# EAGLE design damp_v0003 (EAGLE 6.4)

## Sheet 1 of 2: DAC
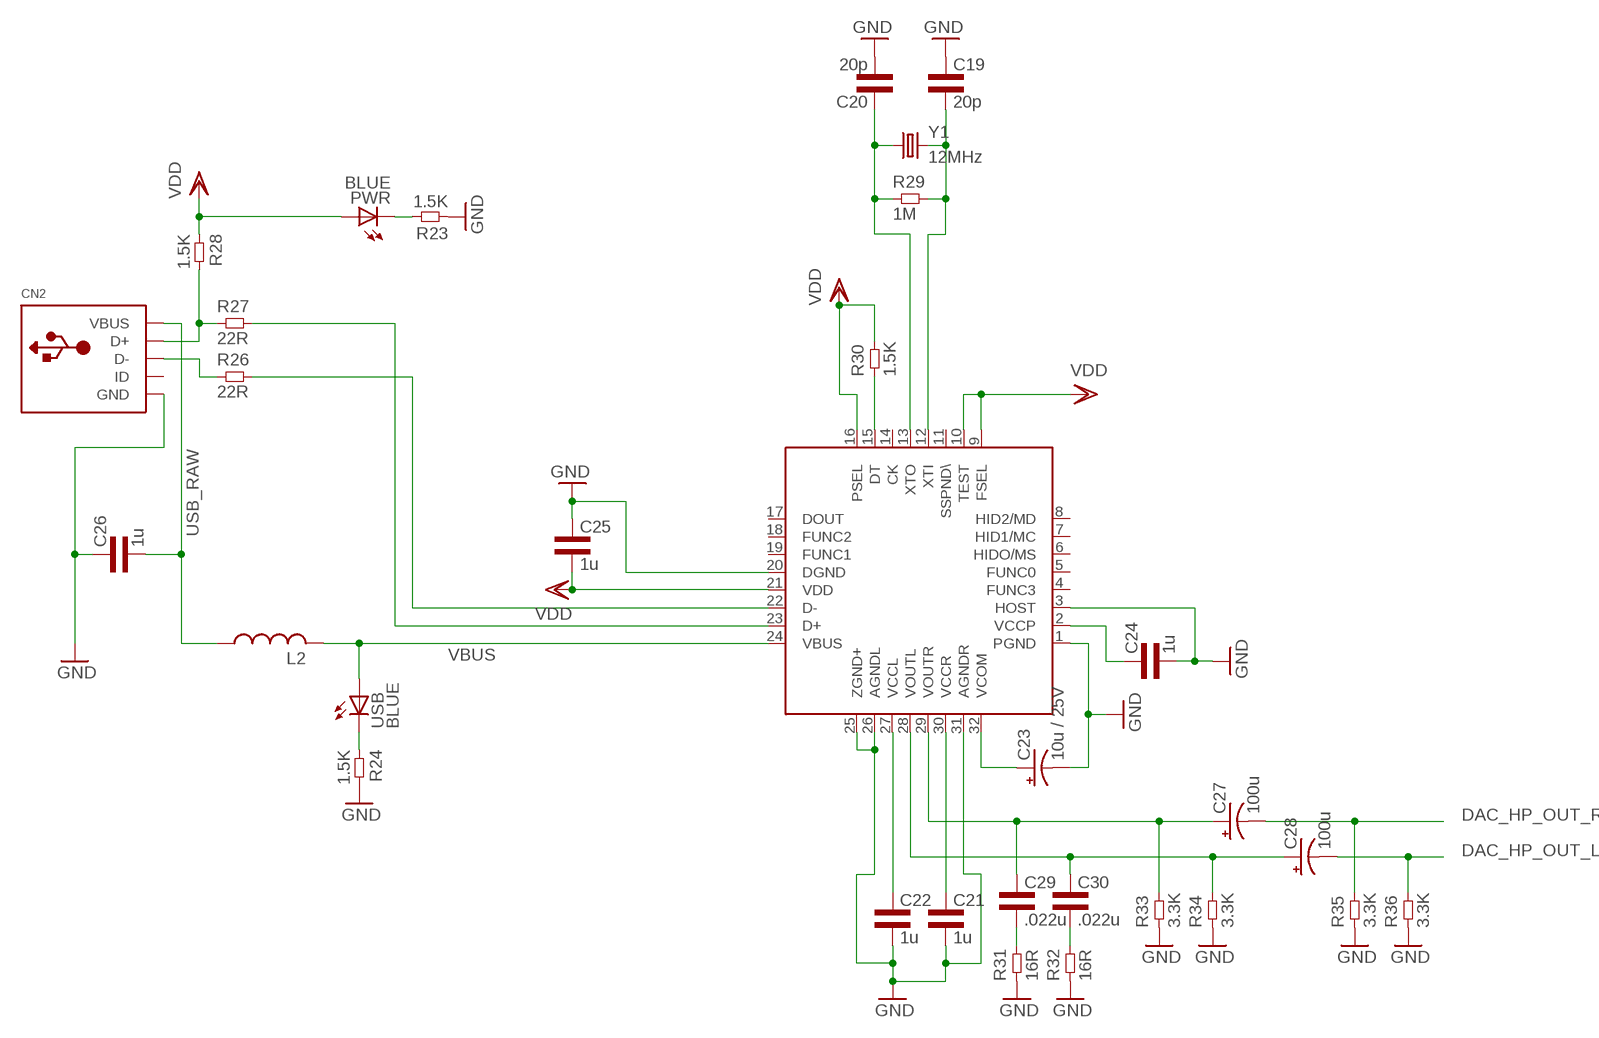
[diagram p0: schematic, sheet 1]

### Parts
C19  20p  CAP0603L3  [0603L3]
C20  20p  CAP0603L3  [0603L3]
C21  1u  CAP0603L3  [0603L3]
C22  1u  CAP0603L3  [0603L3]
C23  10u / 25V  CPOL-USB  [PANASONIC_B]
C24  1u  CAP0603L3  [0603L3]
C25  1u  CAP0603L3  [0603L3]
C26  1u  CAP0603L3  [0603L3]
C27  100u  CPOL-USD  [PANASONIC_D]
C28  100u  CPOL-USD  [PANASONIC_D]
C29  .022u  CAP0603L3  [0603L3]
C30  .022u  CAP0603L3  [0603L3]
CN2  USBMINIB  [USB-MINIB]
L2  RCL_L-USL3225M  [RCL_L3225M]
PWR  BLUE  LED-BLUE0603  [LED-0603]
R23  1.5K  RES0603L3  [0603L3]
R24  1.5K  RES0603L3  [0603L3]
R26  22R  RES0603L3  [0603L3]
R27  22R  RES0603L3  [0603L3]
R28  1.5K  RES0603L3  [0603L3]
R29  1M  RES0603L3  [0603L3]
R30  1.5K  RES0603L3  [0603L3]
R31  16R  RES0603L3  [0603L3]
R32  16R  RES0603L3  [0603L3]
R33  3.3K  RES0603L3  [0603L3]
R34  3.3K  RES0603L3  [0603L3]
R35  3.3K  RES0603L3  [0603L3]
R36  3.3K  RES0603L3  [0603L3]
U$1  PCM2707_V1_PCM2704C_PCM2707  [PCM2707_V1_PCM2704C_PCM2707]
USB  BLUE  LED-BLUE0603  [LED-0603]
Y1  12MHz  CRYSTALHC49US  [HC49US]

### Nets
D_N: CN2.D- R26.P$1
D_P: CN2.D+ R27.P$1 R28.P$2
DAC_HP_OUT_L: C28.- R36.P$2 ; also sheet 2
DAC_HP_OUT_R: C27.- R35.P$2 ; also sheet 2
GND: C19.P$1 C20.P$2 C21.P$2 C22.P$2 C23.- C24.P$2 C25.P$1 C26.P$1 CN2.GND R23.P$1 R24.P$2 R31.P$1 R32.P$1 R33.P$1 R34.P$1 R35.P$1 R36.P$1 U$1.1(PGND) U$1.3(HOST) U$1.20(DGND) U$1.25(ZGND+) U$1.26(AGNDL) U$1.31(AGNDR) ; also sheet 2
N$2: PWR.C R23.P$2
N$6: R24.P$1 USB.C
N$43: C20.P$1 R29.P$1 U$1.13(XTO) Y1.1
N$44: C19.P$2 R29.P$2 U$1.12(XTI) Y1.2
N$45: C22.P$1 U$1.27(VCCL)
N$50: C21.P$1 U$1.30(VCCR)
N$51: C23.+ U$1.32(VCOM)
N$52: C29.P$2 R31.P$2
N$53: C24.P$1 U$1.2(VCCP)
N$54: C27.+ C29.P$1 R33.P$2 U$1.29(VOUTR)
N$57: C28.+ C30.P$1 R34.P$2 U$1.28(VOUTL)
N$58: R30.P$1 U$1.15(DT)
N$59: C30.P$2 R32.P$2
USB_D_N: R26.P$2 U$1.22(D-)
USB_D_P: R27.P$2 U$1.23(D+)
USB_RAW: C26.P$2 CN2.VBUS L2.1
VBUS: L2.2 U$1.24(VBUS) USB.A
VDD: C25.P$2 PWR.A R28.P$1 R30.P$2 U$1.9(FSEL) U$1.10(TEST) U$1.16(PSEL) U$1.21(VDD)
Unconnected: CN2.ID U$1.4(FUNC3) U$1.5(FUNC0) U$1.6(HIDO/MS) U$1.7(HID1/MC) U$1.8(HID2/MD) U$1.11(SSPND\) U$1.14(CK) U$1.17(DOUT) U$1.18(FUNC2) U$1.19(FUNC1)

## Sheet 2 of 2: Amp
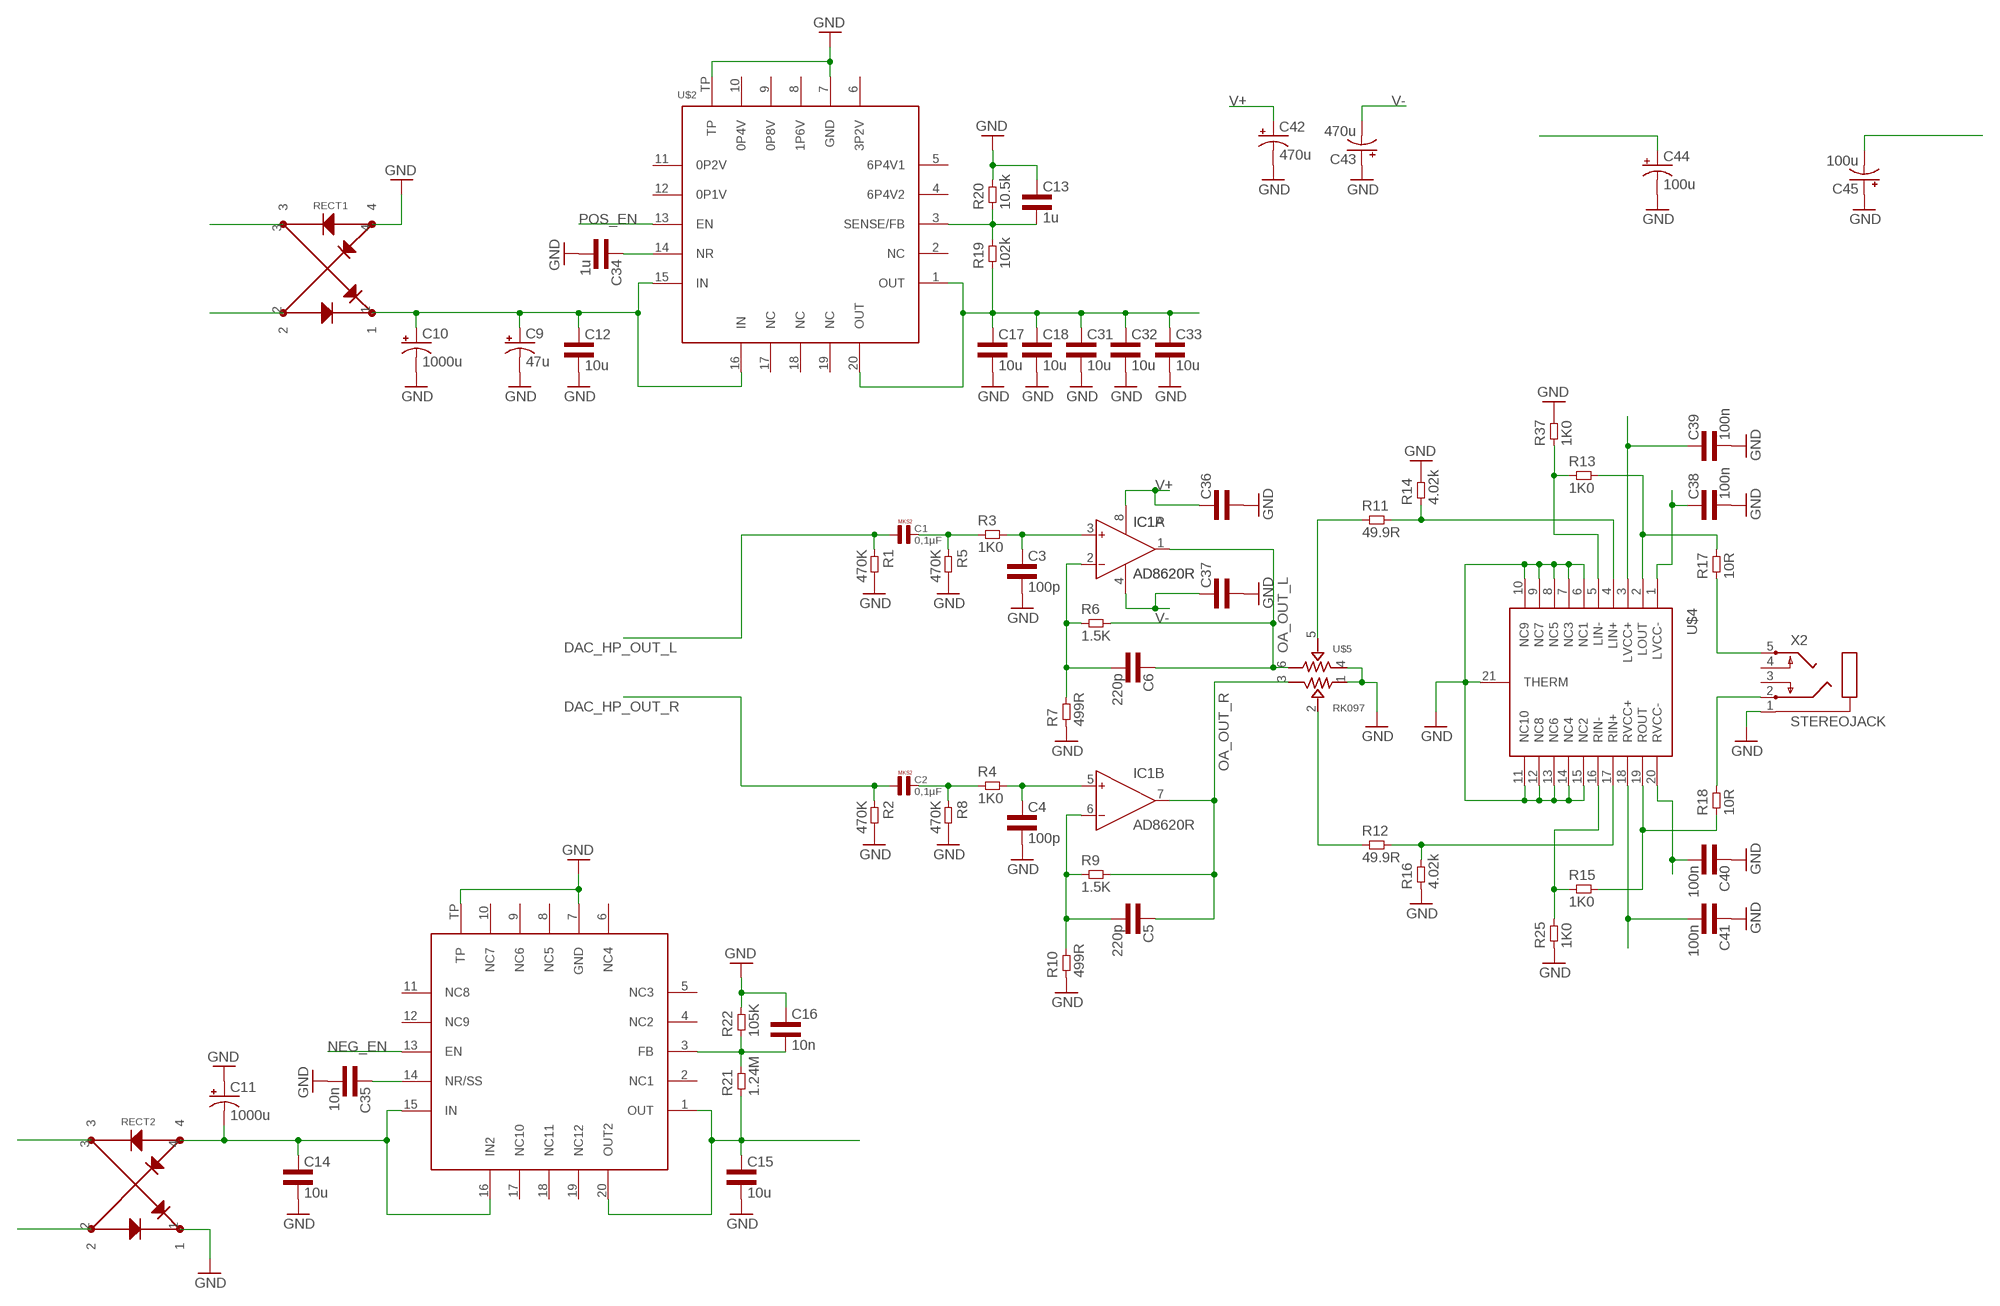
[diagram p1: schematic, sheet 2]

### Parts
C1  0,1µF  [R5B2K5]
C2  0,1µF  [R5B2K5]
C3  100p  CAP0603L3  [0603L3]
C4  100p  CAP0603L3  [0603L3]
C5  220p  CAP0603L3  [0603L3]
C6  220p  CAP0603L3  [0603L3]
C9  47u  CPOL-USCT7343  [CT7343]
C10  1000u  CPOL-USE7.5-18  [E7,5-18]
C11  1000u  CPOL-USE7.5-18  [E7,5-18]
C12  10u  CAP0805L3  [0805L3]
C13  1u  CAP0603L3  [0603L3]
C14  10u  CAP0805L3  [0805L3]
C15  10u  CAP0805L3  [0805L3]
C16  10n  CAP0603L3  [0603L3]
C17  10u  CAP0805L3  [0805L3]
C18  10u  CAP0805L3  [0805L3]
C31  10u  CAP0805L3  [0805L3]
C32  10u  CAP0805L3  [0805L3]
C33  10u  CAP0805L3  [0805L3]
C34  1u  CAP0603L3  [0603L3]
C35  10n  CAP0603L3  [0603L3]
C36  CAP0603L3  [0603L3]
C37  CAP0603L3  [0603L3]
C38  100n  CAP0603L3  [0603L3]
C39  100n  CAP0603L3  [0603L3]
C40  100n  CAP0603L3  [0603L3]
C41  100n  CAP0603L3  [0603L3]
C42  470u  CPOL-USG  [PANASONIC_G]
C43  470u  CPOL-USG  [PANASONIC_G]
C44  100u  CPOL-USD  [PANASONIC_D]
C45  100u  CPOL-USD  [PANASONIC_D]
IC1  AD8620R  [SO8]
R1  470K  RES0603L3  [0603L3]
R2  470K  RES0603L3  [0603L3]
R3  1K0  RES0603L3  [0603L3]
R4  1K0  RES0603L3  [0603L3]
R5  470K  RES0603L3  [0603L3]
R6  1.5K  RES0603L3  [0603L3]
R7  499R  RES0603L3  [0603L3]
R8  470K  RES0603L3  [0603L3]
R9  1.5K  RES0603L3  [0603L3]
R10  499R  RES0603L3  [0603L3]
R11  49.9R  RES0603L3  [0603L3]
R12  49.9R  RES0603L3  [0603L3]
R13  1K0  RES0603L3  [0603L3]
R14  4.02k  RES0603L3  [0603L3]
R15  1K0  RES0603L3  [0603L3]
R16  4.02k  RES0603L3  [0603L3]
R17  10R  RES1206L3  [1206L3]
R18  10R  RES1206L3  [1206L3]
R19  102k  RES0603L3  [0603L3]
R20  10.5k  RES0603L3  [0603L3]
R21  1.24M  RES0603L3  [0603L3]
R22  105K  RES0603L3  [0603L3]
R25  1K0  RES0603L3  [0603L3]
R37  1K0  RES0603L3  [0603L3]
RECT1  RECTIFIER_Z4GP206  [RECTIFIER_ABS-4]
RECT2  RECTIFIER_Z4GP206  [RECTIFIER_ABS-4]
U$2  POWER-SUPPLY_POS_V1_TI_LDO_TPS7A4700  [POWER-SUPPLY_POS_V1_TI_LDO_VQFN-20]
U$3  POWER-SUPPLY_POS_V1_TI_LDO_TPS7A3301RGWT  [POWER-SUPPLY_POS_V1_TI_LDO_VQFN-20]
U$4  PCM2707_V1_AMP_TPA6120_TPA6120  [PCM2707_V1_AMP_TPA6120_TPA6120]
U$5  RK097  [RK097]
X2  STEREOJACK  [STX3100]

### Nets
AC1: RECT1.3
AC2: RECT1.2
AC3: RECT2.3
AC4: RECT2.2
DAC_HP_OUT_L: C1.1 R1.P$1 ; also sheet 1
DAC_HP_OUT_R: C2.1 R2.P$1 ; also sheet 1
GND: C3.P$2 C4.P$2 C9.- C10.- C11.+ C12.2 C13.P$1 C14.2 C15.2 C16.P$1 C17.2 C18.2 C31.2 C32.2 C33.2 C34.P$2 C35.P$2 C36.P$2 C37.P$2 C38.P$2 C39.P$2 C40.P$1 C41.P$1 C42.- C43.+ C44.- C45.+ R1.P$2 R2.P$2 R5.P$2 R7.P$1 R8.P$2 R10.P$1 R14.P$2 R16.P$1 R20.P$2 R22.P$2 R25.P$1 R37.P$2 RECT1.4 RECT2.1 U$2.7(GND) U$2.TP U$3.7(GND) U$3.TP U$4.6(NC1) U$4.7(NC3) U$4.8(NC5) U$4.9(NC7) U$4.10(NC9) U$4.11(NC10) U$4.12(NC8) U$4.13(NC6) U$4.14(NC4) U$4.15(NC2) U$4.21(THERM) U$5.1 U$5.4 X2.1 ; also sheet 1
N$1: R11.P$1 U$5.5
N$3: R11.P$2 R14.P$1 U$4.4(LIN+)
N$4: C34.P$1 U$2.14(NR)
N$7: C1.2 R3.P$1 R5.P$1
N$8: C3.P$1 IC1.3(A:IN+) R3.P$2
N$9: C6.P$2 IC1.2(A:IN-) R6.P$1 R7.P$2
N$10: R12.P$2 R16.P$2 U$4.17(RIN+)
N$11: R12.P$1 U$5.2
N$12: C2.2 R4.P$1 R8.P$1
N$13: C4.P$1 IC1.5(B:IN+) R4.P$2
N$14: R13.P$2 R17.2 U$4.2(LOUT)
N$15: C5.P$2 IC1.6(B:IN-) R9.P$1 R10.P$2
N$16: R15.P$2 R18.1 U$4.19(ROUT)
N$17: R13.P$1 R37.P$1 U$4.5(LIN-)
N$19: R15.P$1 R25.P$2 U$4.16(RIN-)
N$20: R17.1 X2.5
N$22: R18.2 X2.2
N$23: C13.P$2 R19.P$2 R20.P$1 U$2.3(SENSE/FB)
N$24: C16.P$2 R21.P$2 R22.P$1 U$3.3(FB)
N$25: C35.P$1 U$3.14(NR/SS)
NEG_EN: U$3.13(EN)
NEG_RAW: C11.- C14.1 RECT2.4 U$3.15(IN) U$3.16(IN2)
OA_OUT_L: C6.P$1 IC1.1(A:OUT) R6.P$2 U$5.6
OA_OUT_R: C5.P$1 IC1.7(B:OUT) R9.P$2 U$5.3
POS_EN: U$2.13(EN)
POS_RAW: C9.+ C10.+ C12.1 RECT1.1 U$2.15(IN) U$2.16(IN)
V+: C17.1 C18.1 C31.1 C32.1 C33.1 C36.P$1 C39.P$1 C41.P$2 C42.+ C44.+ IC1.8(P:V+) R19.P$1 U$2.1(OUT) U$2.20(OUT) U$4.3(LVCC+) U$4.18(RVCC+)
V-: C15.1 C37.P$1 C38.P$1 C40.P$2 C43.- C45.- IC1.4(P:V-) R21.P$1 U$3.1(OUT) U$3.20(OUT2) U$4.1(LVCC-) U$4.20(RVCC-)
Unconnected: U$2.2(NC) U$2.4(6P4V2) U$2.5(6P4V1) U$2.6(3P2V) U$2.8(1P6V) U$2.9(0P8V) U$2.10(0P4V) U$2.11(0P2V) U$2.12(0P1V) U$2.17(NC) U$2.18(NC) U$2.19(NC) U$3.2(NC1) U$3.4(NC2) U$3.5(NC3) U$3.6(NC4) U$3.8(NC5) U$3.9(NC6) U$3.10(NC7) U$3.11(NC8) U$3.12(NC9) U$3.17(NC10) U$3.18(NC11) U$3.19(NC12) X2.3 X2.4

## Library data of the parts
C1 C2 = Capacitor-Wima-MKS2-63v:0,1µF
C3-C6 C12-C22 C24-C26 C29-C41 = common:CAP
C9-C11 C23 C27 C28 C42-C45 = rcl:CPOL-US: POLARIZED CAPACITOR, American symbol
CN2 = adafruit:USB: USB Connectors USBMINIB - Surface Mount Female Mini-B USB Connector 4UConnector: 06564 By microbuilder.eu Thru-hole RA Female Mini-B USB Connector 4UConnector: 18732 By ladyada.net
IC1 = analog-devices:AD8620: Precision, Very Low Noise, Low Input Bias Current, Wide Bandwidth JFET Operational Amplifiers Source: http://www.analog.com/static/imported-files/data_sheets/AD8610_8620.pdf; MF: ALTERA CORPORATION; MPN: AD8620ARZ; OC_FARNELL: 9994386; OC_NEWARK: 59K6972
L2 = pcm2707_v1:RCL_L-US: INDUCTOR, American symbol
PWR USB = SparkFun-LED:LED-BLUE: Blue LEDs for production use Various blue LEDs stocked by SparkFun production 0603 - DIO-08575 Rebel - DIO-09553 1206 - DIO-09911; PROD_ID: DIO-08575
R1-R37 = common:RES
RECT1 RECT2 = my_dac_amp:RECTIFIER_Z4GP206
U$1 = my_dac_amp:PCM2707_V1_PCM2704C_PCM2707: Upgraded version of the PCM2704. It allows connecting to a device with USB and transmitting that data to another DAC using I2S protocol. Also has other advanced features that allow control with SPI, external buttons, etc.
U$2 = my_dac_amp:POWER-SUPPLY_POS_V1_TI_LDO_TPS7A4700
U$3 = my_dac_amp:POWER-SUPPLY_POS_V1_TI_LDO_TPS7A3301RGWT: Ultra-Low Noise NEGATIVE Voltage Reglator
U$4 = my_dac_amp:PCM2707_V1_AMP_TPA6120_TPA6120
U$5 = SparkFun-Electromechanical:RK097
X2 = adafruit:STEREOJACK: MIC/HEADPHONE JACK Stereo jack with two switches. Kycon STX3100, CUI SJ1-3555NG and/or 4UCon 05544
Y1 = SparkFun-FreqCtrl:CRYSTAL: Various standard crystals. Proven footprints. Spark Fun Electronics SKU : COM-00534

## Board
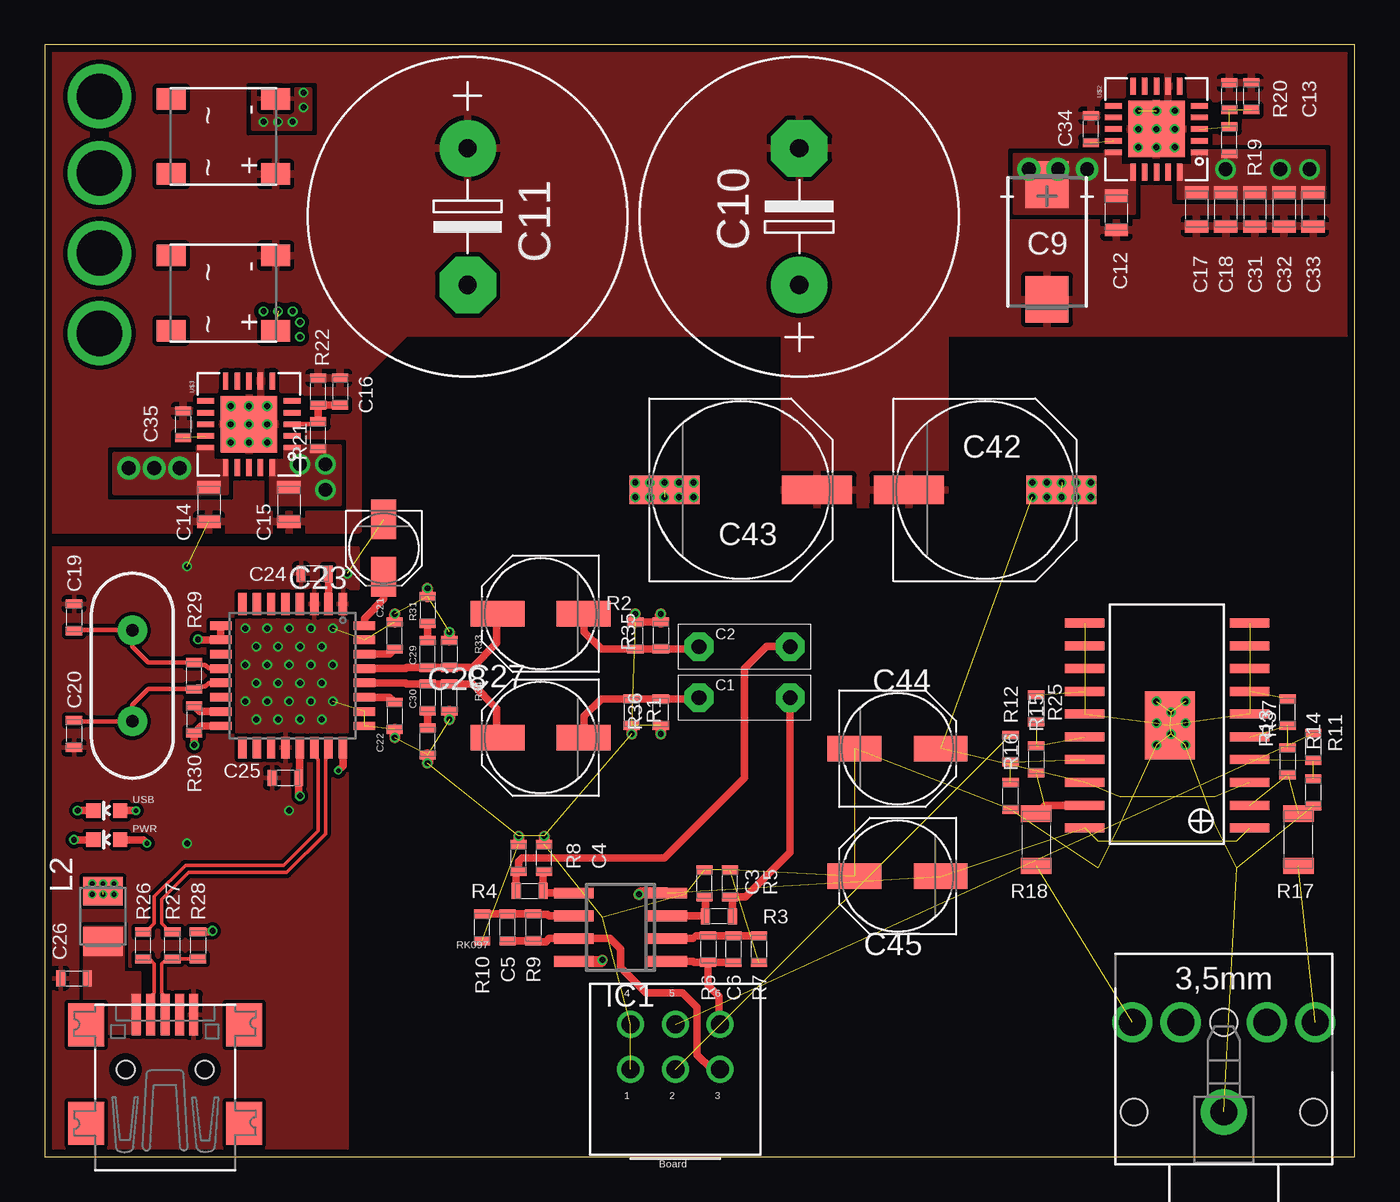
[diagram p2: board, top side]
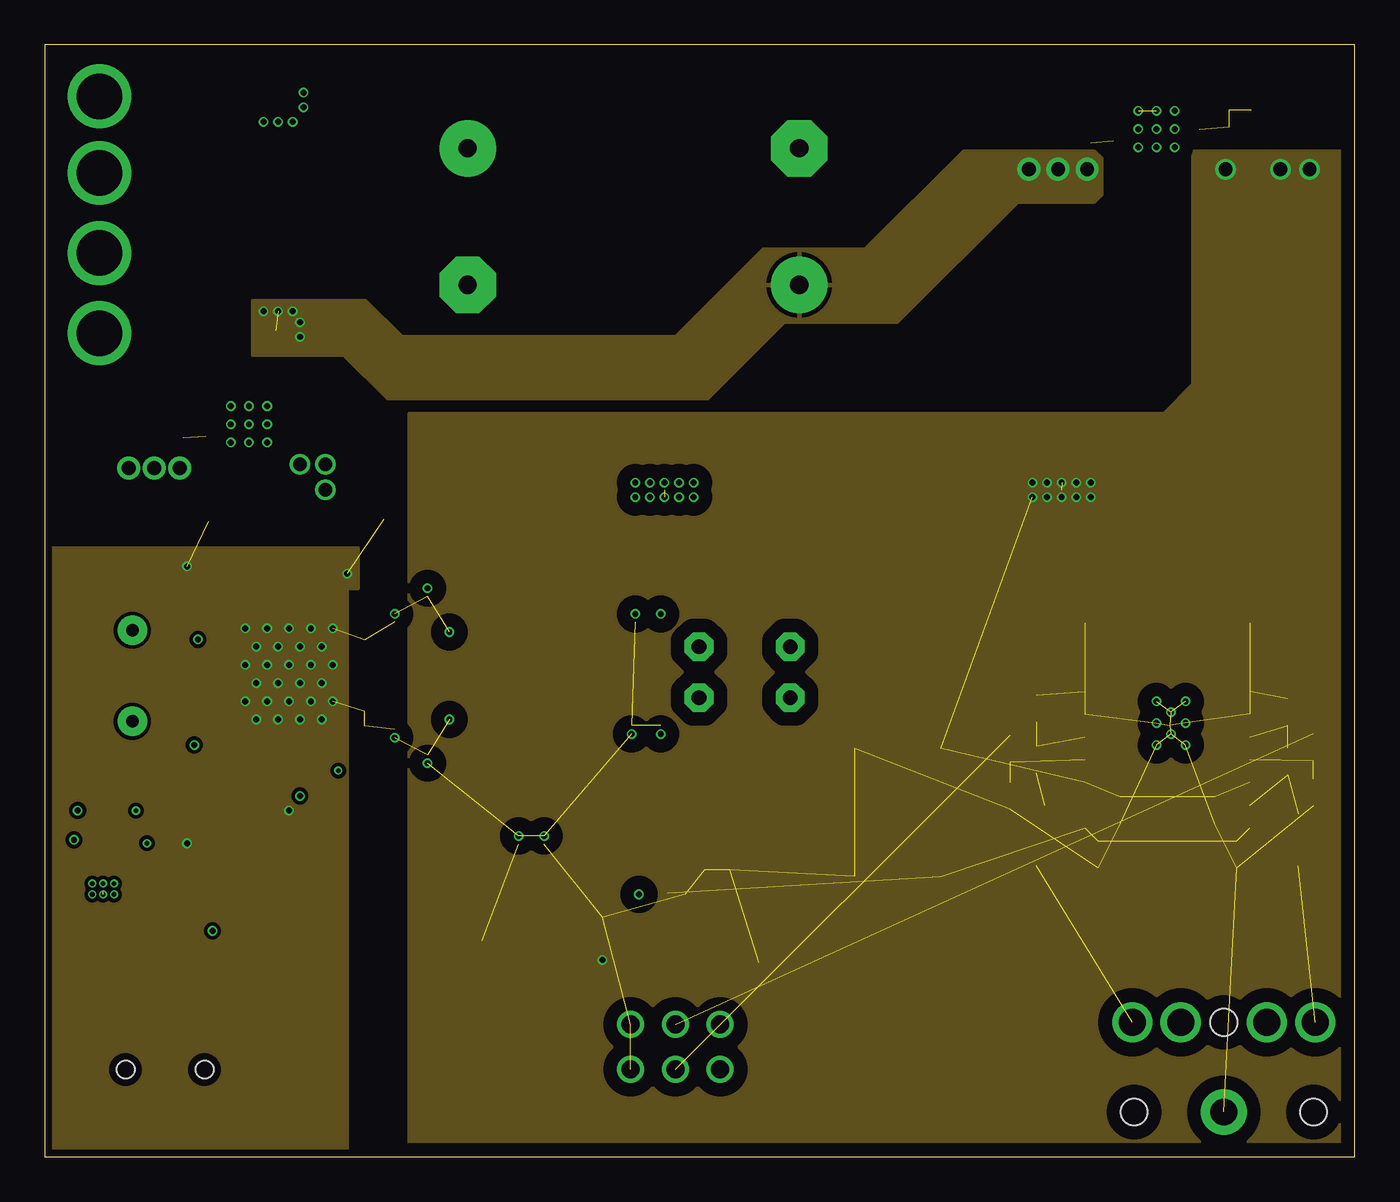
[diagram p3: board, inner layer Route2]
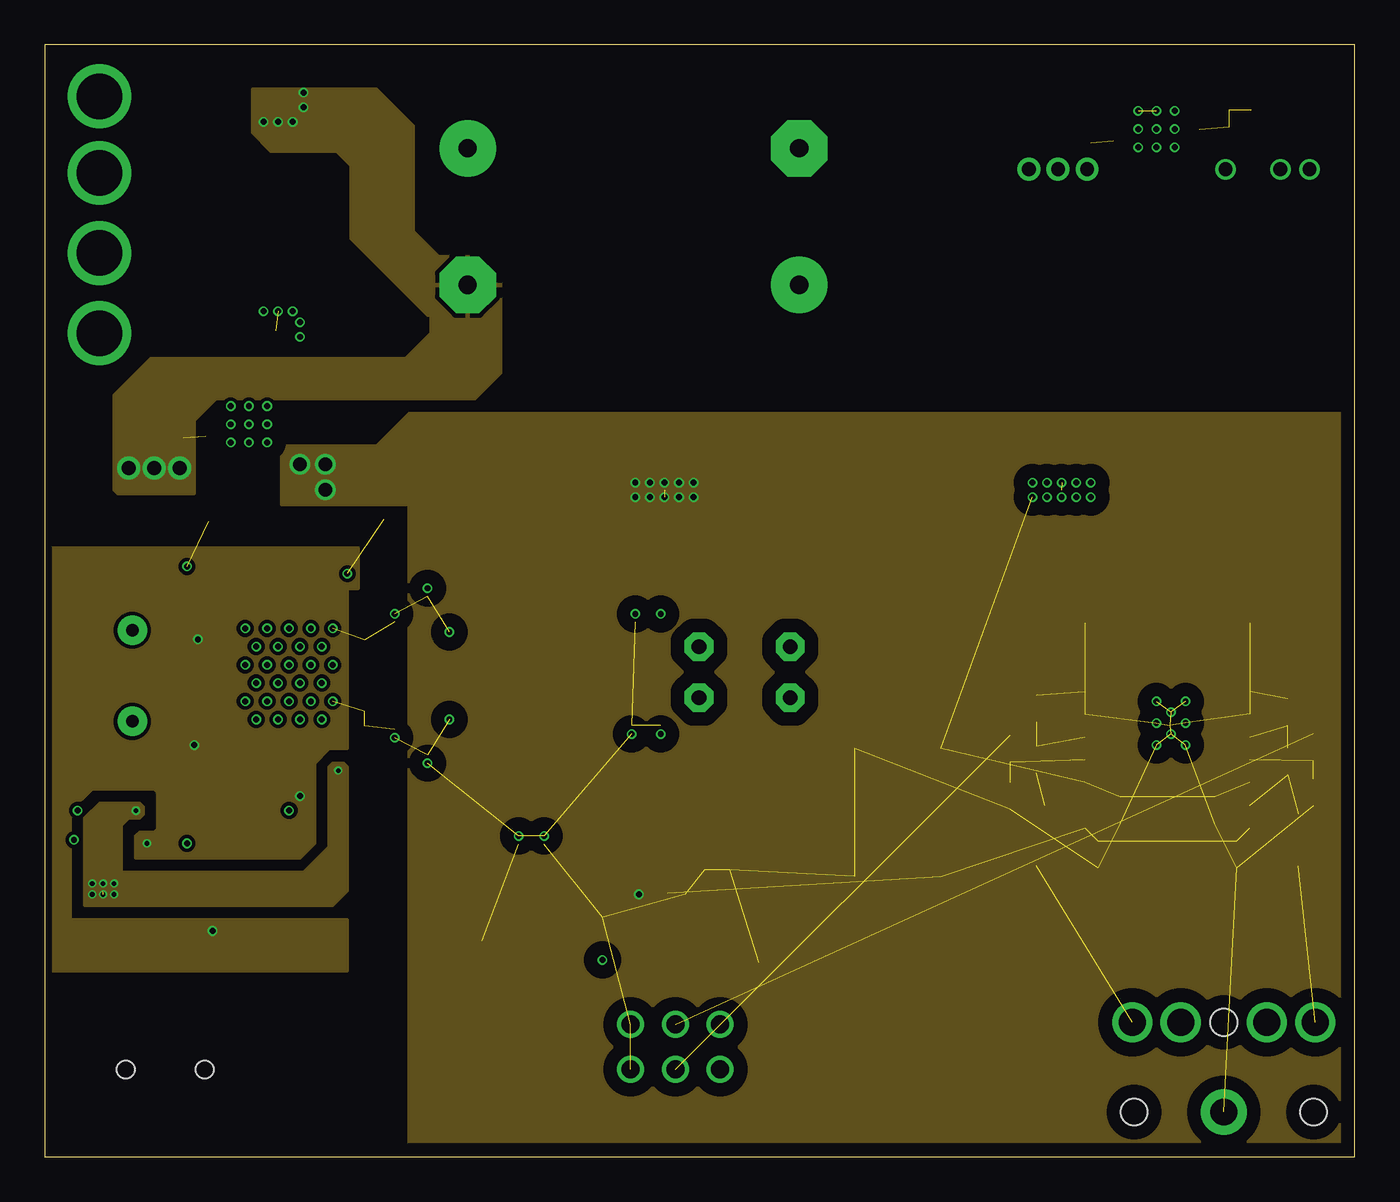
[diagram p4: board, inner layer Route3]
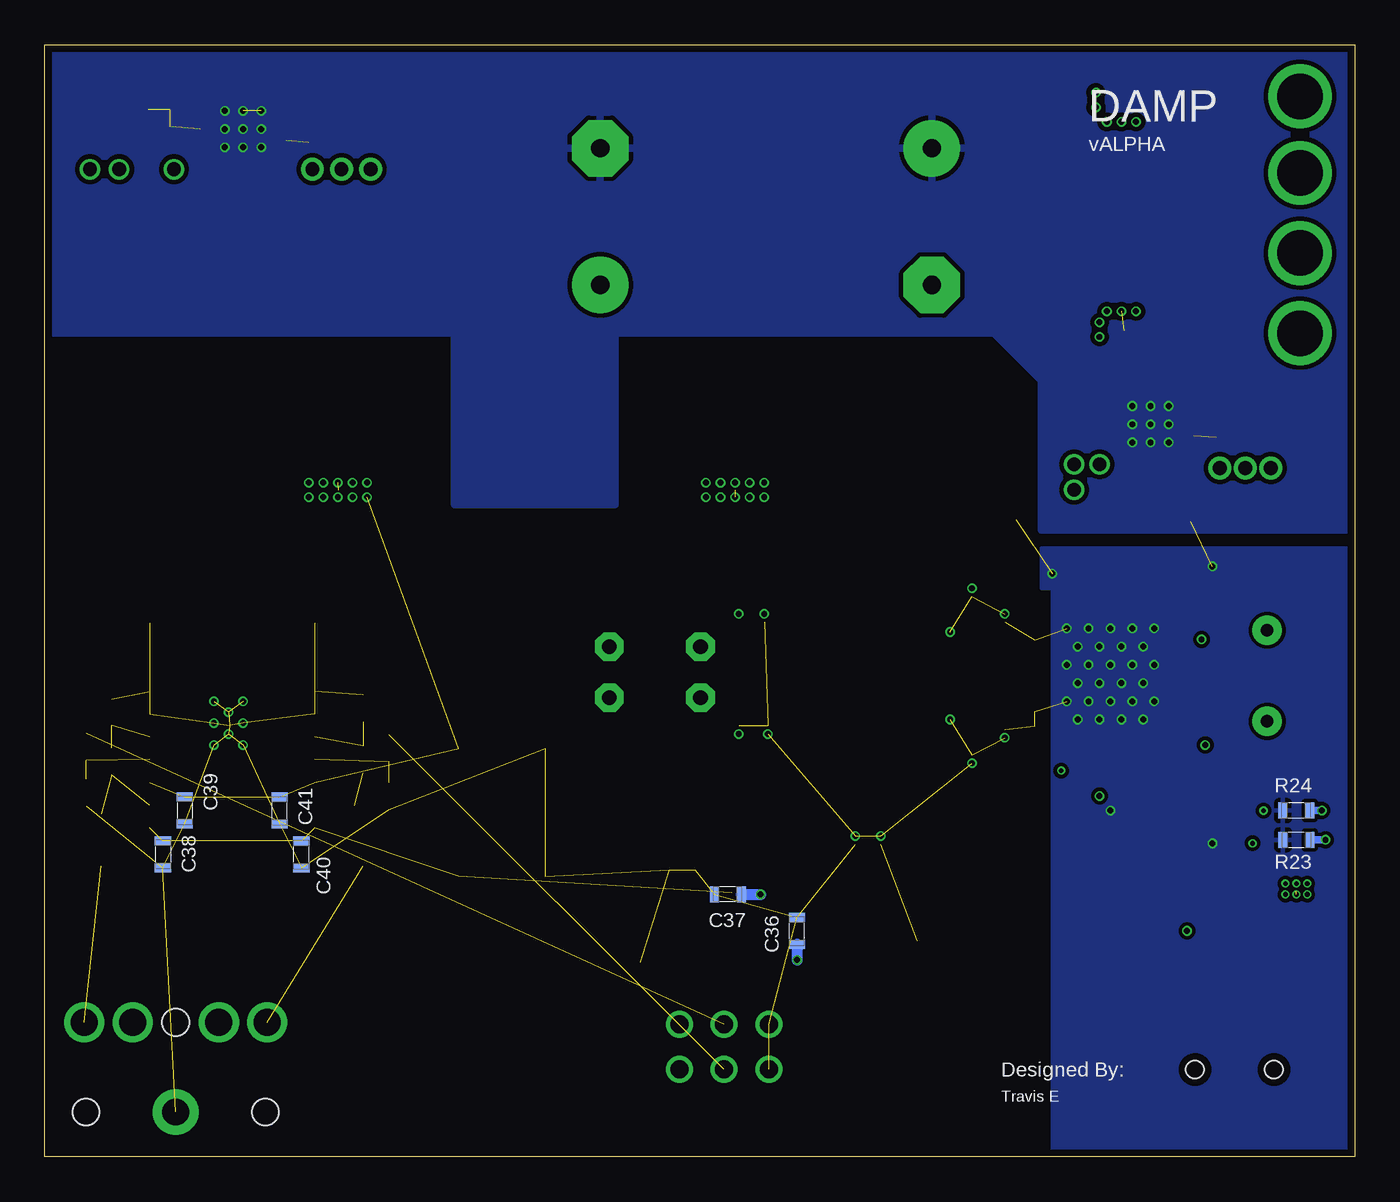
[diagram p5: board, bottom side, seen from below]

Size 73.03 x 62 mm. Coordinates in mm from the lower left corner, seen from the top.
Outline: 0,0 73.03,0 73.03,62 0,62 0,0
Copper layers (1*2*3*16): Top 0.035mm / dielectric 1.5mm / Route2 0.035mm / dielectric 0.15mm / Route3 0.035mm / dielectric 0.2mm / Bottom 0.035mm
Design rules "default *": minimum track width 5mil, minimum drill 10mil, track to track 8mil, track to pad 8mil, pad to pad 8mil, via to via 8mil, smd to smd 0mil, copper to edge 16mil, drill to drill 8mil, minimum pad ring 4mil, minimum via ring 4mil, stop-mask expansion 4mil, vias tented up to drill 18mil, thermal gap 10mil

### Footprints (pad centres in the part's own frame; a part is rotated, then mirrored left to right if it is on the bottom)
R5B2K5 = drill 0.813 pad 1.6 octagon: 1 -2.54,0; 2 2.54,0
0603L3 = smd 0.5 x 0.9: P$1 -0.75,0; P$2 0.75,0
CT7343 = smd 2.6 x 2.4: + -3.2,0; - 3.2,0
E7,5-18 = drill 1.016 pad 3.15: + -3.81,0 | drill 1.016 pad 3.15 octagon: - 3.81,0
0805L3 = smd 0.7 x 1.3: 1 -0.95,0; 2 0.95,0
PANASONIC_B = smd 2.2 x 1.4: + 1.6,0; - -1.6,0
PANASONIC_D = smd 3 x 1.4: + 2.4,0; - -2.4,0
PANASONIC_G = smd 3.9 x 1.6: + 4.25,0; - -4.25,0
USB-MINIB = smd 0.5 x 2.308: D+ 0,4.064; D- -0.8,4.064; GND 1.6,4.064; ID 0.8,4.064; VBUS -1.6,4.064 | smd 2 x 2.4: GND1 -4.4,-2; GND2 -4.4,3.5; GND3 4.4,3.5; GND4 4.4,-2 | hole 1: -2.2,1; 2.2,1
SO8 = smd 0.6 x 2.2: 1 -1.905,-2.6; 2 -0.635,-2.6; 3 0.635,-2.6; 4 1.905,-2.6; 5 1.905,2.6; 6 0.635,2.6; 7 -0.635,2.6; 8 -1.905,2.6
RCL_L3225M = smd 1.6 x 2.2: 1 -1.4,0; 2 1.4,0
LED-0603 = smd 0.8 x 0.8: A 0,-0.75; C 0,0.75
1206L3 = smd 0.9 x 1.7: 1 -1.45,0; 2 1.45,0
RECTIFIER_ABS-4 = smd 1.2 x 1.6: 1 2.1,2.91; 2 2.1,-2.91; 3 -2.1,-2.91; 4 -2.1,2.91
PCM2707_V1_PCM2704C_PCM2707 = smd 0.47 x 1.2: 1 -2.8,-4; 2 -2,-4; 3 -1.2,-4; 4 -0.4,-4; 5 0.4,-4; 6 1.2,-4; 7 2,-4; 8 2.8,-4; 17 2.8,4; 18 2,4; 19 1.2,4; 20 0.4,4; 21 -0.4,4; 22 -1.2,4; 23 -2,4; 24 -2.8,4 | smd 1.2 x 0.47: 9 4,-2.8; 10 4,-2; 11 4,-1.2; 12 4,-0.4; 13 4,0.4; 14 4,1.2; 15 4,2; 16 4,2.8; 25 -4,2.8; 26 -4,2; 27 -4,1.2; 28 -4,0.4; 29 -4,-0.4; 30 -4,-1.2; 31 -4,-2; 32 -4,-2.8
POWER-SUPPLY_POS_V1_TI_LDO_VQFN-20 = smd 0.3 x 0.95: 1 -1.3,-2.4; 2 -0.65,-2.4; 3 0,-2.4; 4 0.65,-2.4; 5 1.3,-2.4; 11 1.3,2.4; 12 0.65,2.4; 13 0,2.4; 14 -0.65,2.4; 15 -1.3,2.4 | smd 0.95 x 0.3: 6 2.4,-1.3; 7 2.4,-0.65; 8 2.4,0; 9 2.4,0.65; 10 2.4,1.3; 16 -2.4,1.3; 17 -2.4,0.65; 18 -2.4,0; 19 -2.4,-0.65; 20 -2.4,-1.3 | smd 3.15 x 3.15: TP 0,0
PCM2707_V1_AMP_TPA6120_TPA6120 = smd 0.5 x 2.2: 1 0.25,1.095; 2 1.52,1.095; 3 2.79,1.095; 4 4.06,1.095; 5 5.33,1.095; 6 6.6,1.095; 7 7.87,1.095; 8 9.14,1.095; 9 10.41,1.095; 10 11.68,1.095; 11 11.68,10.295; 12 10.41,10.295; 13 9.14,10.295; 14 7.87,10.295; 15 6.6,10.295; 16 5.33,10.295; 17 4.06,10.295; 18 2.79,10.295; 19 1.52,10.295; 20 0.25,10.295 | smd 3.81 x 2.79: 21 5.965,5.54
RK097 = drill 1: 1 2.5,0; 2 0,0; 3 -2.5,0; 4 2.5,-2.5; 5 0,-2.5; 6 -2.5,-2.5
STX3100 = drill 1.5 pad 2.54: 1 2.7,-0.1 | drill 1.5: 2 7.7,5; 3 7.7,2.3; 4 7.7,-2.5; 5 7.7,-5.2 | hole 1.5: 2.7,4.9; 2.7,-5.1; 7.7,-0.1
HC49US = drill 0.7 pad 1.651: 1 -2.54,0; 2 2.54,0

### Placement (x,y rotation side)
C1  39.01,25.6 0 top
C2  39.01,28.45 0 top
C3  36.78,15.24 90 top
C4  27.84,16.66 90 top
C5  25.81,12.8 90 top
C6  38.4,11.58 90 top
C9  55.88,51 270 top
C10  42.06,52.43 90 top
C11  23.57,52.43 270 top
C12  59.74,52.63 270 top
C13  67.26,59.13 270 top
C14  9.14,36.37 270 top
C15  13.61,36.37 270 top
C16  16.46,42.67 270 top
C17  64.21,52.83 270 top
C18  65.84,52.83 270 top
C19  1.63,30.07 270 top
C20  1.63,23.57 270 top
C21  19.51,29.06 90 top
C22  19.51,24.59 270 top
C23  18.9,33.93 270 top
C24  15.04,32.51 180 top
C25  13.41,21.13 0 top
C26  1.63,9.96 0 top
C27  27.64,30.28 180 top
C28  27.64,23.37 180 top
C29  21.34,28.04 90 top
C30  21.34,25.6 270 top
C31  67.46,52.83 270 top
C32  69.09,52.83 270 top
C33  70.71,52.83 270 top
C34  58.32,57.3 90 top
C35  7.72,40.84 90 top
C36  31.09,12.6 90 bottom
C37  34.95,14.63 180 bottom
C38  66.45,16.87 270 bottom
C39  65.23,19.3 270 bottom
C40  58.72,16.87 90 bottom
C41  59.94,19.3 90 bottom
C42  52.43,37.19 0 top
C43  38.81,37.19 0 top
C44  47.55,22.76 0 top
C45  47.55,15.65 180 top
CN2  6.71,3.86 0 top
IC1  32.11,12.8 90 top
L2  3.25,13.41 90 top
PWR  3.45,17.68 90 top
R1  32.72,24.79 270 top
R2  32.92,29.06 90 top
R3  37.59,13.41 180 top
R4  27.03,14.83 0 top
R5  38.2,15.24 90 top
R6  36.98,11.58 270 top
R7  39.83,11.58 90 top
R8  26.42,16.66 90 top
R9  27.23,12.8 270 top
R10  24.38,12.8 90 top
R11  70.71,22.86 270 top
R12  53.85,22.76 270 top
R13  69.29,22.05 270 top
R14  70.71,20.32 270 top
R15  55.27,22.15 270 top
R16  53.85,20.12 90 top
R17  69.9,17.68 90 top
R18  55.27,17.68 270 top
R19  66.04,56.69 90 top
R20  66.04,59.13 90 top
R21  15.24,40.23 90 top
R22  15.24,42.67 90 top
R23  3.25,17.68 0 bottom
R24  3.25,19.3 180 bottom
R25  55.27,24.99 270 top
R26  5.49,11.79 90 top
R27  7.11,11.79 90 top
R28  8.53,11.79 270 top
R29  8.33,26.82 90 top
R30  8.33,24.38 270 top
R31  21.34,30.48 270 top
R32  21.34,23.16 90 top
R33  22.56,28.04 270 top
R34  22.56,25.6 90 top
R35  34.34,29.06 270 top
R36  34.34,24.79 90 top
R37  69.29,24.79 90 top
RECT1  9.96,48.16 270 top
RECT2  9.96,56.9 270 top
U$1  13.82,26.82 180 top
U$2  61.98,57.3 90 top
U$3  11.38,40.84 90 top
U$4  68.28,18.08 90 top
U$5  35.15,4.88 180 top
USB  3.45,19.3 90 top
X2  65.63,-0.2 90 top
Y1  4.88,26.82 90 top

### Tracks (layer width: path | path; a pad name or v marks a point on that pad's centre or on a via)
D_N
  Top 0.203: CN2.D- 5.91,8.95 6.1,9.14 6.1,10.77 5.89,10.97 5.55,10.97 R26.P$1
D_P
  Top 0.203: CN2.D+ 6.71,8.94 6.5,9.14 6.5,10.77 6.91,11.18 6.97,11.18 R27.P$1 R28.P$2
DAC_HP_OUT_L
  Top 0.406: C28.- 30.07,23.41 30.07,24.59 31.03,25.54 R1.P$1 R36.P$2 36.41,25.54 C1.1
DAC_HP_OUT_R
  Top 0.406: C27.- 30.07,30.24 30.07,29.26 31.03,28.31 R2.P$1 R35.P$2 36.33,28.31 C2.1
GND  (via drill 0.33)  (55 unrouted)
  Top 0.203: 27.84,17.48 C4.P$2 | 26.42,17.48 R8.P$2
  Top 0.406: R2.P$2 R35.P$1
  Top 0.61: C22.P$2 v19.51,23.37 | R32.P$1 v21.34,21.95 | R34.P$1 v22.55,24.38 | R33.P$1 v22.55,29.26 | R31.P$1 v21.34,31.7 | C21.P$2 v19.51,30.28 | R2.P$2 v32.92,30.28 | R35.P$1 v34.34,30.28 | R1.P$2 v32.72,23.57 | R36.P$1 v34.34,23.57 | v27.84,17.88 27.84,17.48 | v26.42,17.88 26.42,17.48
  other vias: 16.87,32.51 13.61,19.3 12.4,29.46 13.61,29.46 14.83,29.46 16.05,29.46 13,28.45 14.22,28.45 15.44,28.45 16.05,27.43 14.83,27.43 13.61,27.43 12.4,27.43 13,26.42 14.22,26.42 15.44,26.42 63.6,25.4 61.98,25.4 62.79,24.79 63.6,24.18 61.98,24.18 62.79,23.57 63.6,22.96 61.98,22.96 7.92,32.92 7.92,17.48 11.18,29.46 11.79,28.45 11.18,27.43 11.79,26.42 11.18,25.4 12.4,25.4 13.61,25.4 14.83,25.4 16.05,25.4 11.79,24.38 13,24.38 14.22,24.38 15.44,24.38 11.38,40.84 10.36,41.86 10.36,40.84 10.36,39.83 11.38,39.83 11.38,41.86 12.4,41.86 12.4,40.84 12.4,39.83 61.98,57.3 60.96,58.32 60.96,57.3 60.96,56.29 61.98,56.29 62.99,56.29 62.99,57.3 62.99,58.32 61.98,58.32
  pour Top (rank 6): 0.41,33.93 17.48,33.93 17.48,31.7 16.87,31.7 16.87,0.2 0.41,0.2
  pour Route2: 0.41,33.93 17.48,33.93 17.48,31.7 16.87,31.7 16.87,0.2 0.41,0.2
  pour Bottom: 0.41,33.93 17.48,33.93 17.48,31.7 16.87,31.7 16.87,0.2 0.41,0.2
  pour Top (isolate 0.254, rank 6): 0.41,61.57 72.54,61.57 72.54,45.92 50.19,45.92 50.19,36.37 41.25,36.37 41.25,45.92 20.12,45.92 17.88,43.69 17.48,43.28 17.48,34.95 0.41,34.95
  pour Bottom (isolate 0.254, rank 6): 0.41,61.57 72.54,61.57 72.54,45.92 50.19,45.92 50.19,36.37 41.25,36.37 41.25,45.92 20.12,45.92 17.88,43.69 17.48,43.28 17.48,34.95 0.41,34.95
N$1  (1 unrouted)
N$2  (via drill 0.33)
  Top 0.406: PWR.C v1.63,17.68
  Bottom 0.406: R23.P$2 v1.63,17.68
N$3  (2 unrouted)
N$4  (1 unrouted)
N$5  (via drill 2.54)
  other vias: 3.05,50.39
N$6  (via drill 0.33)
  Top 0.406: USB.C v1.83,19.3
  Bottom 0.406: R24.P$1 v1.83,19.3
N$7
  Top 0.406: C1.2 41.55,16.97 39.08,14.49 R5.P$1 38.34,14.35 R3.P$1
N$8
  Top 0.406: IC1.3 36.82,13.44 R3.P$2 36.84,14.43 C3.P$1
N$9
  Top 0.406: IC1.2 36.14,12.17 36.31,12.33 R6.P$1 C6.P$2 R7.P$2
N$10  (2 unrouted)
N$11  (1 unrouted)
N$12
  Top 0.406: R4.P$1 26.28,15.77 R8.P$1 26.42,16.46 26.62,16.66 34.54,16.66 39.01,21.13 39.01,27.23 40.23,28.45 C2.2
N$13
  Top 0.406: IC1.5 27.9,14.71 R4.P$2 27.78,15.85 C4.P$1
N$14  (2 unrouted)
N$15
  Top 0.406: IC1.6 28.12,13.44 28.04,13.51 27.27,13.51 R9.P$1 C5.P$2 R10.P$2
N$16  (1 unrouted)
  Top 0.406: U$4.19 55.75,19.61 R18.1
N$17  (2 unrouted)
N$18  (via drill 2.54)
  other vias: 3.05,45.92
N$19  (2 unrouted)
N$20  (1 unrouted)
N$21  (via drill 2.54)
  other vias: 3.05,54.86
N$22  (1 unrouted)
N$23  (3 unrouted)
N$24
  Top 0.254: U$3.3 15.1,40.84 R21.P$2
  Top 0.406: R21.P$2 R22.P$1 C16.P$2
N$25  (1 unrouted)
N$26  (via drill 2.54)
  other vias: 3.05,59.13
N$43
  Top 0.254: U$1.13 9.15,26.42 8.94,26.21 8.47,26.21 R29.P$1 5.75,26.07 4.88,25.2 Y1.1 1.66,24.28 C20.P$1
N$44
  Top 0.254: U$1.12 9.15,27.22 8.94,27.43 8.47,27.43 R29.P$2 5.75,27.57 4.88,28.45 Y1.2 1.66,29.36 C19.P$2
N$45
  Top 0.406: U$1.27 19.22,25.62 C22.P$1
N$50
  Top 0.406: U$1.30 19.22,28.02 C21.P$1
N$51
  Top 0.406: U$1.32 17.82,30.01 18.9,31.09 C23.+
N$52
  Top 0.406: C29.P$2 R31.P$2
N$53
  Top 0.406: U$1.2 15.82,32.4 C24.P$1
N$54
  Top 0.406: U$1.29 20.11,27.22 20.18,27.29 C29.P$1 R33.P$2 23.84,27.29 25.2,28.65 25.2,30.24 C27.+
N$57
  Top 0.406: U$1.28 20.11,26.42 20.18,26.35 C30.P$1 R34.P$2 23.84,26.35 25.2,24.99 25.2,23.41 C28.+
N$58
  Top 0.406: U$1.15 8.64,24.82 R30.P$1
N$59
  Top 0.406: C30.P$2 R32.P$2
NEG_RAW  (via drill 0.33, 0.76 pad 1.27)
  other vias: 4.67,38.4 6.1,38.4 7.52,38.4 12.19,57.71 13,57.71 13.82,57.71 14.43,58.52 14.43,59.33
  pour Top (no thermals): 9.35,39.62 8.53,39.62 8.53,39.22 3.86,39.22 3.86,36.98 10.16,36.98 10.16,38.81 9.35,38.81
  pour Route3: 11.58,59.54 11.58,57.1 12.6,56.08 16.26,56.08 17.07,55.27 17.07,51.21 21.34,46.94 24.38,46.94 25.2,47.75 25.2,49.38 24.38,50.19 21.95,50.19 20.52,51.61 20.52,57.51 18.49,59.54
  pour Route3: 21.54,50.19 21.54,45.92 20.12,44.5 5.89,44.5 3.86,42.47 3.86,37.19 4.06,36.98 8.33,36.98 8.33,41.05 9.55,42.27 23.98,42.27 25.4,43.69 25.4,49.99 25.2,50.19
  pour Top: 11.58,59.54 11.58,57.3 14.83,57.3 14.83,59.54
OA_OUT_L
  Top 0.406: C6.P$1 R6.P$2 | R6.P$2 36.21,10.83 36.14,10.9 IC1.1 | R6.P$2 36.98,9.55 37.59,8.94 37.59,7.44 U$5.6
OA_OUT_R
  Top 0.406: C5.P$1 R9.P$2 27.29,11.99 27.94,11.99 28.12,12.17 IC1.7 31.52,12.17 32.11,11.58 32.11,10.57 33.53,9.14 35.56,9.14 36.37,8.33 36.37,5.69 37.19,4.88 U$5.3
POS_RAW  (via drill 0.33, 0.76 pad 1.27)  (1 unrouted)
  other vias: 58.12,55.07 56.49,55.07 54.86,55.07 12.19,47.14 13,47.14 13.82,47.14 14.22,46.53 14.22,45.72
  pour Top (no thermals): 59.13,56.08 59.13,55.88 54.05,55.88 54.05,52.63 60.76,52.63 60.76,55.27 59.94,55.27 59.94,56.08
  pour Route2: 11.58,47.75 17.88,47.75 19.91,45.72 35.15,45.72 40.03,50.6 45.72,50.6 51.21,56.08 58.52,56.08 58.93,55.68 58.93,53.64 58.52,53.24 54.25,53.24 47.55,46.53 41.25,46.53 36.98,42.27 19.1,42.27 16.66,44.7 11.58,44.7
USB_D_N
  Top 0.203: R26.P$2 5.63,12.54 6.1,13 6.1,14.51 7.84,16.26 13.33,16.26 15.24,18.17 15.24,22.15 15.02,22.37 U$1.22
USB_D_P
  Top 0.203: R27.P$2 6.97,12.54 6.5,13 6.5,14.34 8.01,15.85 13.5,15.85 15.65,18 15.65,22.15 15.82,22.32 U$1.23
USB_RAW
  pour Top (no thermals): 4.37,12.8 2.24,12.8 2.24,6.91 5.28,6.91 5.28,10.26 4.37,10.26
V+  (via drill 0.33, 0.76)  (6 unrouted)
  Top 0.61: IC1.8 31.01,10.9 v31.09,10.97
  Bottom 0.61: C36.P$1 v31.09,10.97
  other vias: 55.07,37.59 55.07,36.78 55.88,37.59 55.88,36.78 56.69,36.78 56.69,37.59 57.51,37.59 57.51,36.78 58.32,37.59 58.32,36.78 65.84,55.07 68.88,55.07 70.51,55.07
  pour Top (no thermals): 64.01,56.08 64.01,55.27 63.2,55.27 63.2,53.44 71.32,53.44 71.32,56.08
  pour Route2 (isolate 0.762): 64.01,55.88 64.01,43.08 62.38,41.45 20.32,41.45 20.32,0.41 72.54,0.41 72.54,56.08 64.01,56.08
V-  (via drill 0.33, 0.76)  (6 unrouted)
  Top 0.61: IC1.4 33.2,14.71 v33.12,14.63
  Bottom 0.61: C37.P$1 v33.12,14.63
  other vias: 32.92,37.59 32.92,36.78 33.73,37.59 33.73,36.78 34.54,37.59 34.54,36.78 35.36,36.78 35.36,37.59 36.17,37.59 36.17,36.78 14.22,38.61 15.65,37.19 15.65,38.61
  pour Top (no thermals): 13.41,39.62 16.46,39.62 16.46,36.37 12.6,36.37 12.6,38.81 13.41,38.81
  pour Route3 (isolate 0.762): 13.41,39.62 18.49,39.62 20.32,41.45 72.54,41.45 72.54,0.41 20.32,0.41 20.32,36.37 13.21,36.37 13.21,39.62
VBUS  (via drill 0.25)  (1 unrouted)
  Top 0.406: U$1.24 16.62,21.8 v16.36,21.54 | USB.A v5.08,19.3
  other vias: 2.64,15.24 3.25,15.24 3.86,15.24 2.64,14.63 3.25,14.63 3.86,14.63
  pour Route3: 16.05,14.02 2.24,14.02 2.24,18.9 3.05,19.71 5.28,19.71 5.49,19.51 5.49,19.1 5.28,18.9 4.67,18.9 4.27,18.49 4.27,15.85 14.43,15.85 15.85,17.27 15.85,21.74 16.05,21.95 16.66,21.95 16.87,21.74 16.87,14.83
VDD  (via drill 0.25, 0.33)
  Top 0.406: U$1.21 14.22,21.19 C25.P$2 14.16,20.18 v14.22,20.12 | U$1.9 U$1.10 8.57,28.82 v8.53,28.85 | U$1.16 8.72,24.02 R30.P$2 v8.33,22.96 | PWR.A 5.49,17.68 v5.69,17.48 | R28.P$1 9.28,12.54 v9.35,12.6
  pour Route3: 0.41,33.93 17.48,33.93 17.48,31.7 16.87,31.7 16.87,22.76 15.85,22.76 15.04,21.95 15.04,17.48 14.22,16.66 5.08,16.66 5.08,17.88 5.28,18.08 6.1,18.08 6.3,18.29 6.3,20.32 6.1,20.52 2.64,20.52 1.42,19.3 1.42,13.21 16.87,13.21 16.87,10.36 0.41,10.36

### Text on the board
bPlace: DAMP | vALPHA | Designed By: | Travis E